# EAGLE design mini-midi-merge (EAGLE 6.6.0)
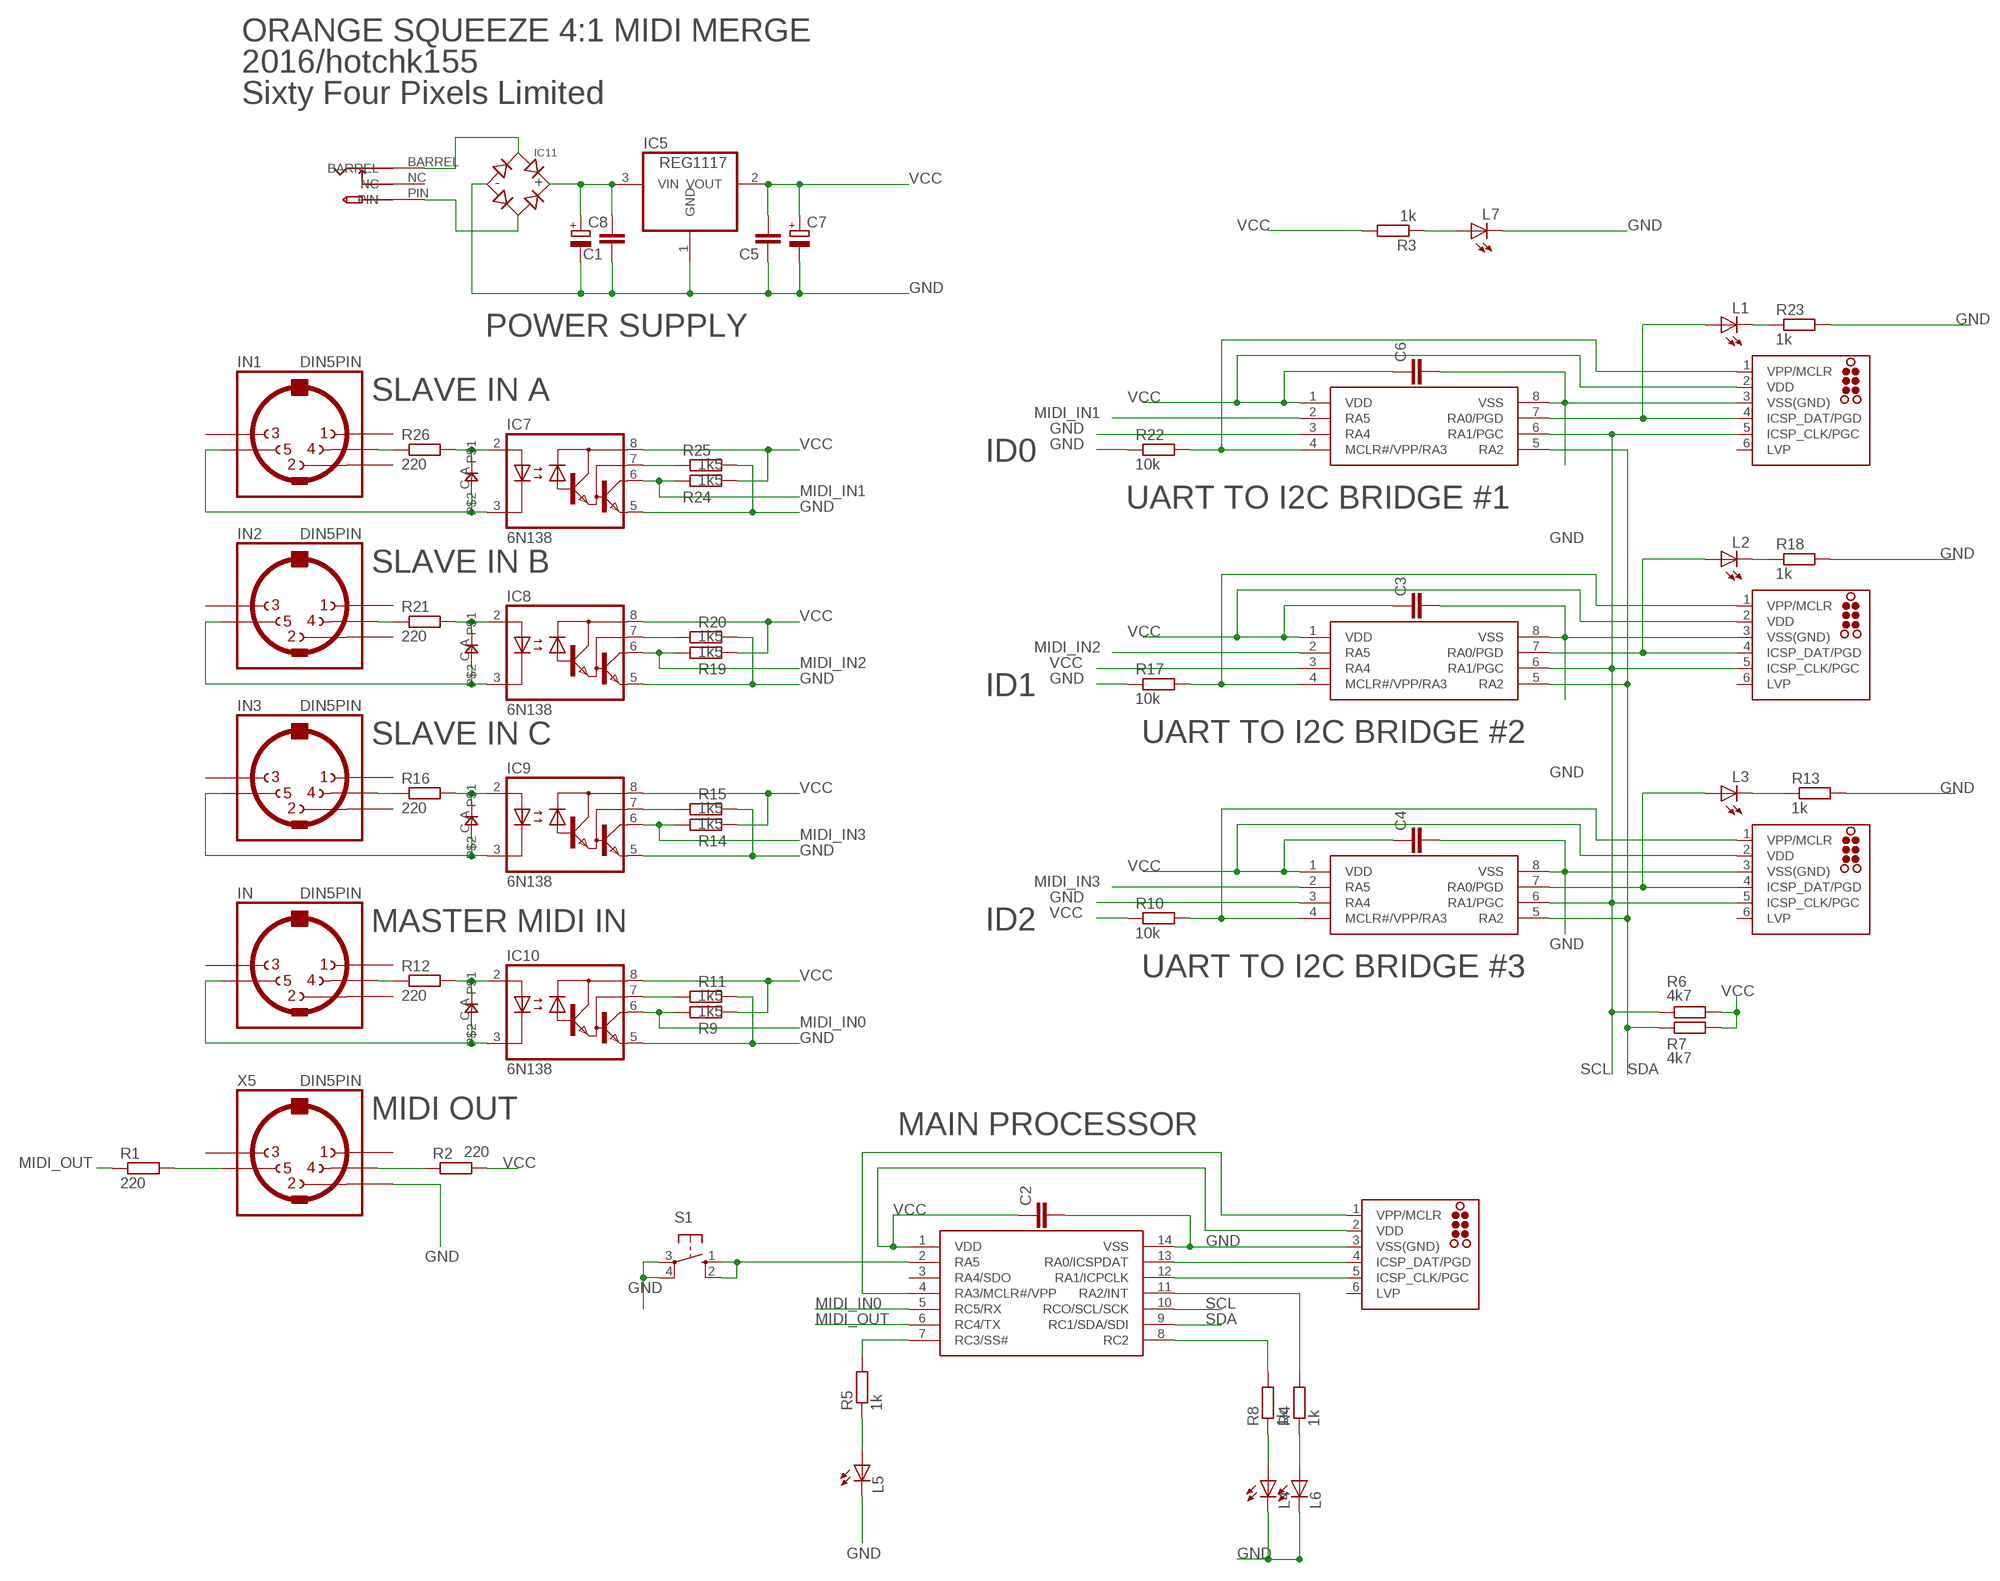
[diagram p0: schematic, sheet 1]

## Parts
C1  C-EUC0805  [C0805]
C2  C-EUC0805  [C0805]
C3  C-EUC0805  [C0805]
C4  C-EUC0805  [C0805]
C5  C-EUC0805  [C0805]
C6  C-EUC0805  [C0805]
C7  CPOL-EUE2,5-6E  [E2,5-6E]
C8  CPOL-EUE2,5-6E  [E2,5-6E]
D1  0805DIODE  [0805DIODE]
D2  0805DIODE  [0805DIODE]
D3  0805DIODE  [0805DIODE]
D4  0805DIODE  [0805DIODE]
IC1  PIC16F1825SO14  [SO14]
IC2  PIC12F1822SO08  [SO08]
IC3  PIC12F1822SO08  [SO08]
IC4  PIC12F1822SO08  [SO08]
IC5  REG1117  [SOT223]
IC7  6N138  [DIL08]
IC8  6N138  [DIL08]
IC9  6N138  [DIL08]
IC10  6N138  [DIL08]
IC11  BRIDGERECTIFIER  [SOIC-4]
ICSP1  TC2030-MCP-NL  [TC2030-MCP-NL]
ICSP2  TC2030-MCP-NL  [TC2030-MCP-NL]
ICSP3  TC2030-MCP-NL  [TC2030-MCP-NL]
ICSP4  TC2030-MCP-NL  [TC2030-MCP-NL]
IN  DIN5PIN  [EDGEDIN]
IN1  DIN5PIN  [EDGEDIN]
IN2  DIN5PIN  [EDGEDIN]
IN3  DIN5PIN  [EDGEDIN]
L1  LED3MM  [LED3MM]
L2  LED3MM  [LED3MM]
L3  LED3MM  [LED3MM]
L4  LED3MM  [LED3MM]
L5  LED3MM  [LED3MM]
L6  LED3MM  [LED3MM]
L7  LED3MM  [LED3MM]
R1  220  R-EU_R0805  [R0805]
R2  220  R-EU_R0805  [R0805]
R3  1k  R-EU_R0805  [R0805]
R4  1k  R-EU_R0805  [R0805]
R5  1k  R-EU_R0805  [R0805]
R6  4k7  R-EU_R0805  [R0805]
R7  4k7  R-EU_R0805  [R0805]
R8  1k  R-EU_R0805  [R0805]
R9  1k5  R-EU_R0805  [R0805]
R10  10k  R-EU_R0805  [R0805]
R11  1k5  R-EU_R0805  [R0805]
R12  220  R-EU_R0805  [R0805]
R13  1k  R-EU_R0805  [R0805]
R14  1k5  R-EU_R0805  [R0805]
R15  1k5  R-EU_R0805  [R0805]
R16  220  R-EU_R0805  [R0805]
R17  10k  R-EU_R0805  [R0805]
R18  1k  R-EU_R0805  [R0805]
R19  1k5  R-EU_R0805  [R0805]
R20  1k5  R-EU_R0805  [R0805]
R21  220  R-EU_R0805  [R0805]
R22  10k  R-EU_R0805  [R0805]
R23  1k  R-EU_R0805  [R0805]
R24  1k5  R-EU_R0805  [R0805]
R25  1k5  R-EU_R0805  [R0805]
R26  220  R-EU_R0805  [R0805]
S1  10-XX  [B3F-10XX]
U$9  PWR_SOCKET_2_1MM  [PWR_SOCKET_2_1MM]
X5  DIN5PIN  [EDGEDIN]

## Nets
GND: C1.1 C2.2 C3.2 C4.2 C5.1 C6.2 C7.- C8.- IC1.14(VSS) IC2.3(RA4) IC2.8(VSS) IC3.8(VSS) IC4.3(RA4) IC4.8(VSS) IC5.1(GND) IC7.5(GND) IC8.5(GND) IC9.5(GND) IC10.5(GND) IC11.- ICSP1.3(VSS(GND)) ICSP2.3(VSS(GND)) ICSP3.3(VSS(GND)) ICSP4.3(VSS(GND)) L4.K(C) L5.K(C) L6.K(C) L7.K(C) R11.2 R13.2 R15.2 R17.1 R18.2 R20.2 R22.1 R23.2 R25.2 S1.3(P) S1.4(P1) X5.2
MIDI_IN0: IC1.5(RC5/RX) IC10.6(VO) R9.1
MIDI_IN1: IC4.2(RA5) IC7.6(VO) R24.1
MIDI_IN2: IC3.2(RA5) IC8.6(VO) R19.1
MIDI_IN3: IC2.2(RA5) IC9.6(VO) R14.1
MIDI_OUT: IC1.6(RC4/TX) R1.1
N$1: IN3.4 R16.1
N$2: D2.A IC9.2(A) R16.2
N$3: D2.C IC9.3(C) IN3.5
N$4: IN2.4 R21.1
N$5: IC9.7(VB) R15.1
N$6: D3.A IC8.2(A) R21.2
N$7: D3.C IC8.3(C) IN2.5
N$8: IC8.7(VB) R20.1
N$9: IN1.4 R26.1
N$10: D4.A IC7.2(A) R26.2
N$11: D4.C IC7.3(C) IN1.5
N$12: IC7.7(VB) R25.1
N$13: IN.4 R12.1
N$14: D1.A IC10.2(A) R12.2
N$15: D1.C IC10.3(C) IN.5
N$16: IC10.7(VB) R11.1
N$17: IC3.4(MCLR#/VPP/RA3) ICSP3.1(VPP/MCLR) R17.2
N$18: IC4.4(MCLR#/VPP/RA3) ICSP4.1(VPP/MCLR) R22.2
N$19: L4.A R8.1
N$20: C1.2 C8.+ IC5.3(VIN) IC11.+
N$21: L7.A R3.1
N$22: R1.2 X5.5
N$23: IC4.7(RA0/PGD) ICSP4.4(ICSP_DAT/PGD) L1.A
N$24: L1.K(C) R23.1
N$25: IC2.7(RA0/PGD) ICSP2.4(ICSP_DAT/PGD) L3.A
N$26: L2.K(C) R18.1
N$27: IC2.4(MCLR#/VPP/RA3) ICSP2.1(VPP/MCLR) R10.2
N$28: R2.1 X5.4
N$30: IC3.7(RA0/PGD) ICSP3.4(ICSP_DAT/PGD) L2.A
N$31: L3.K(C) R13.1
N$32: IC1.4(RA3/MCLR#/VPP) ICSP1.1(VPP/MCLR)
N$33: L6.A R4.1
N$34: IC1.13(RA0/ICSPDAT) ICSP1.4(ICSP_DAT/PGD)
N$35: IC1.12(RA1/ICPCLK) ICSP1.5(ICSP_CLK/PGC)
N$36: IC1.8(RC2) R8.2
N$37: IC1.11(RA2/INT) R4.2
N$38: IC11.~1(AC1) U$9.BARREL
N$39: IC11.~2(AC2) U$9.PIN
N$40: IC1.2(RA5) S1.1(S) S1.2(S1)
N$41: IC1.7(RC3/SS#) R5.2
N$42: L5.A R5.1
SCL: IC1.10(RCO/SCL/SCK) IC2.6(RA1/PGC) IC3.6(RA1/PGC) IC4.6(RA1/PGC) ICSP2.5(ICSP_CLK/PGC) ICSP3.5(ICSP_CLK/PGC) ICSP4.5(ICSP_CLK/PGC) R6.1
SDA: IC1.9(RC1/SDA/SDI) IC2.5(RA2) IC3.5(RA2) IC4.5(RA2) R7.1
VCC: C2.1 C3.1 C4.1 C5.2 C6.1 C7.+ IC1.1(VDD) IC2.1(VDD) IC3.1(VDD) IC3.3(RA4) IC4.1(VDD) IC5.2(VOUT) IC7.8(VCC) IC8.8(VCC) IC9.8(VCC) IC10.8(VCC) ICSP1.2(VDD) ICSP2.2(VDD) ICSP3.2(VDD) ICSP4.2(VDD) R2.2 R3.2 R6.2 R7.2 R9.2 R10.1 R14.2 R19.2 R24.2
Unconnected: IC1.3(RA4/SDO) ICSP1.6(LVP) ICSP2.6(LVP) ICSP3.6(LVP) ICSP4.6(LVP) IN1.1 IN1.2 IN1.3 IN2.1 IN2.2 IN2.3 IN3.1 IN3.2 IN3.3 IN.1 IN.2 IN.3 U$9.NC X5.1 X5.3

## Notes on the sheet
- ORANGE SQUEEZE 4:1 MIDI MERGE
- 2016/hotchk155
- Sixty Four Pixels Limited
- POWER SUPPLY
- SLAVE IN A
- ID0
- UART TO I2C BRIDGE #1
- SLAVE IN B
- ID1
- SLAVE IN C | UART TO I2C BRIDGE #2
- MASTER MIDI IN | ID2
- UART TO I2C BRIDGE #3
- MIDI OUT
- MAIN PROCESSOR

## Library data of the parts
C1-C6 = rcl:C-EU: CAPACITOR, European symbol
C7 C8 = rcl:CPOL-EU: POLARIZED CAPACITOR, European symbol
D1-D4 = jasons_stuff:0805DIODE
IC1 = jasons_stuff:PIC16F1825
IC2-IC4 = jasons_stuff:PIC12F1822
IC5 = burr-brown:REG1117: 800mA and 1A Low Dropout (LDO) Positive Regulator 1.8V, 2.5V, 2.85V, 3.3V, 5V, and Adj; MPN: REG1117; OC_FARNELL: 1097566; OC_NEWARK: 14P6981
IC7-IC10 = optocoupler:6N138: MOTOROLA OPTO COUPLER; MF: VISHAY/TELEFUNKEN; MPN: 6N138; OC_FARNELL: 9860150; OC_NEWARK: 35K5294
IC11 = microbuilder:BRIDGERECTIFIER: Bridge Rectifier SOIC-4: Comchip B4S-G - 400V 800mA, Peak Vf 1.1V (Digikey: 641-1334-1-ND)
ICSP1-ICSP4 = tag-connect:TC2030: TAG-CONNECT ICSP Connector Manufacturer: Tag-Connect <http://www.tag-connect.com> Cable for easy In-Circuit Serial Programming. Designed for Microchip ICD2, suitable for many others. Two variants - one "with legs" (for hands-free fit on PCB) and another "without legs" for quick programming. PAD Description 1 MCLR/Vpp 2 Vdd 3 GND 4 PGD (ISPDAT) 5 PGC (ISPCLK) 6 nc (used for LVP) ©2009 ROFA.cz - modified and updated by Robert Darlington ‹rdarlington@gmail.com›
IN IN1-IN3 X5 = jason_eagle6:DIN5PIN: Female CONNECTOR 5 pins 90 deg. with shield, horizontal (DIN 41524)
L1-L7 = led:LED: LED OSRAM: - CHIPLED LG R971, LG N971, LY N971, LG Q971, LY Q971, LO R971, LY R971 LH N974, LH R974 LS Q976, LO Q976, LY Q976 LO Q996 - Hyper CHIPLED LW Q18S LB Q993, LB Q99A, LB R99A - SideLED LS A670, LO A670, LY A670, LG A670, LP A670 LB A673, LV A673, LT A673, LW A673 LH A674 LY A675 LS A676, LA A676, LO A676, LY A676, LW A676 LS A679, LY A679, LG A679 - Hyper Micro SIDELED® LS Y876, LA Y876, LO Y876, LY Y876 LT Y87S - SmartLED LW L88C, LW L88S LB L89C, LB L89S, LG L890 LS L89K, LO L89K, LY L89K LS L896, LA L896, LO L896, LY L896 - TOPLED LS T670, LO T670, LY T670, LG T670, LP T670 LSG T670, LSP T670, LSY T670, LOP T670, LYG T670 LG T671, LOG T671, LSG T671 LB T673, LV T673, LT T673, LW T673 LH T674 LS T676, LA T676, LO T676, LY T676, LB T676, LH T676, LSB T676, LW T676 LB T67C, LV T67C, LT T67C, LS T67K, LO T67K, LY T67K, LW E67C LS E67B, LA E67B, LO E67B, LY E67B, LB E67C, LV E67C, LT E67C LW T67C LS T679, LY T679, LG T679 LS T770, LO T770, LY T770, LG T770, LP T770 LB T773, LV T773, LT T773, LW T773 LH T774 LS E675, LA E675, LY E675, LS T675 LS T776, LA T776, LO T776, LY T776, LB T776 LHGB T686 LT T68C, LB T68C - Hyper Mini TOPLED® LB M676 - Mini TOPLED Santana® LG M470 LS M47K, LO M47K, LY M47K Source: http://www.osram.convergy.de LUXEON: - LUMILED® LXK2-PW12-R00, LXK2-PW12-S00, LXK2-PW14-U00, LXK2-PW14-V00 LXK2-PM12-R00, LXK2-PM12-S00, LXK2-PM14-U00 LXK2-PE12-Q00, LXK2-PE12-R00, LXK2-PE12-S00, LXK2-PE14-T00, LXK2-PE14-U00 LXK2-PB12-K00, LXK2-PB12-L00, LXK2-PB12-M00, LXK2-PB14-N00, LXK2-PB14-P00, LXK2-PB14-Q00 LXK2-PR12-L00, LXK2-PR12-M00, LXK2-PR14-Q00, LXK2-PR14-R00 LXK2-PD12-Q00, LXK2-PD12-R00, LXK2-PD12-S00 LXK2-PH12-R00, LXK2-PH12-S00 LXK2-PL12-P00, LXK2-PL12-Q00, LXK2-PL12-R00 Source: www.luxeon.com KINGBRIGHT: KA-3528ASYC Source: www.kingbright.com
R1-R26 = rcl:R-EU_: RESISTOR, European symbol
S1 = switch-omron:10-XX: OMRON SWITCH; MPN: B3F-1000; OC_FARNELL: 176432; OC_NEWARK: 36M3542
U$9 = jason_eagle6:PWR_SOCKET_2_1MM

## Board
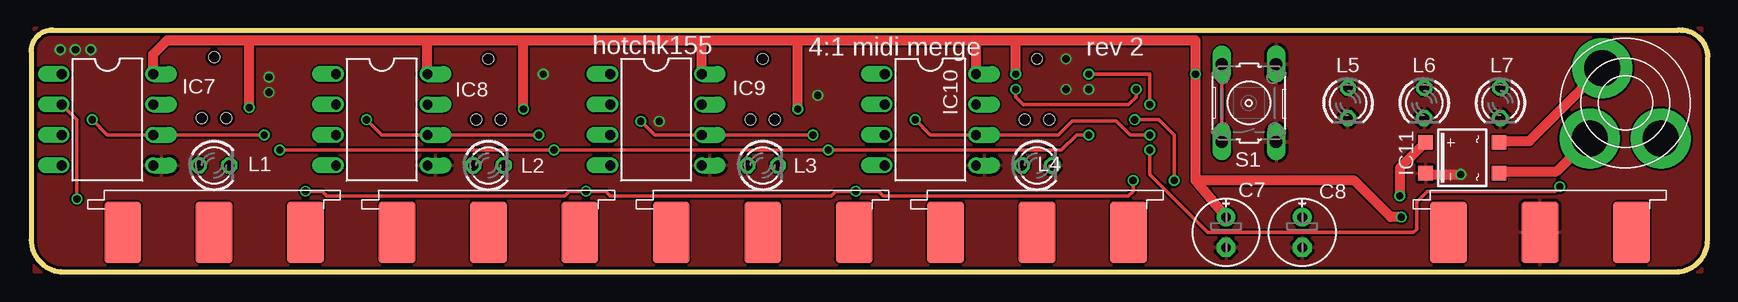
[diagram p1: board, top side]
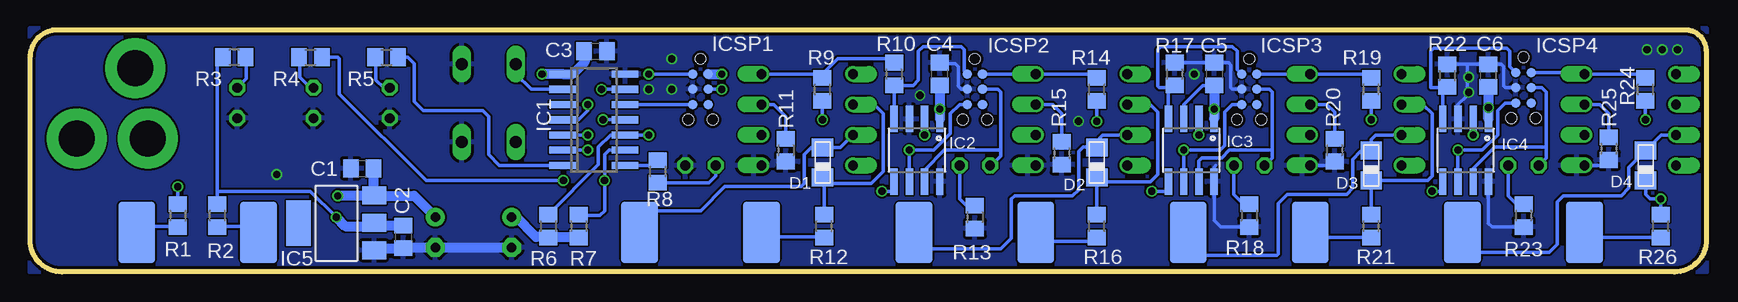
[diagram p2: board, bottom side, seen from below]

Size 139.7 x 20.19 mm. Coordinates in mm from the lower left corner, seen from the top.
Outline: 137.29,20.19 1.78,20.19 arc90 0,18.41 0,2.67 arc90 2.67,0 137.03,0 arc90 139.7,2.67 139.7,17.91 arc90 137.41,20.19
Copper layers (1*16): Top 0.035mm / dielectric 1.5mm / Bottom 0.035mm
Design rules "ITEADstudio_DRC": minimum track width 6mil, minimum drill 12mil, track to track 6mil, track to pad 6mil, pad to pad 6mil, via to via 6mil, smd to smd 0mil, copper to edge 10mil, drill to drill 10mil, minimum pad ring 10mil, minimum via ring 6mil, stop-mask expansion 2mil, vias tented up to drill 100mil, thermal gap 10mil

### Footprints (pad centres in the part's own frame; a part is rotated, then mirrored left to right if it is on the bottom)
C0805 = smd 1.3 x 1.5: 1 -0.95,0; 2 0.95,0
E2,5-6E = drill 0.813 pad 1.575: + -1.27,0 | drill 0.813 pad 1.575 octagon: - 1.27,0
0805DIODE = smd 1.524 x 1.778: A -1.262,-0.005; C 1.238,-0.005
SO14 = smd 0.6 x 2.2: 1 -3.81,-2.6; 2 -2.54,-2.6; 3 -1.27,-2.6; 4 0,-2.6; 5 1.27,-2.6; 6 2.54,-2.6; 7 3.81,-2.6; 8 3.81,2.6; 9 2.54,2.6; 10 1.27,2.6; 11 0,2.6; 12 -1.27,2.6; 13 -2.54,2.6; 14 -3.81,2.6
SO08 = smd 0.61 x 2.21: 1 -1.905,-2.616; 2 -0.635,-2.616; 3 0.635,-2.616; 4 1.905,-2.616; 5 1.905,2.616; 6 0.635,2.616; 7 -0.635,2.616; 8 -1.905,2.616
SOT223 = smd 1.499 x 2.007: 1 -2.261,-3.15; 2 0.025,-3.15; 3 2.311,-3.15 | smd 3.81 x 2.007: 4 0,3.15
DIL08 = drill 0.813 offset: 1 -3.81,-3.81; 2 -1.27,-3.81; 3 1.27,-3.81; 4 3.81,-3.81; 5 3.81,3.81; 6 1.27,3.81; 7 -1.27,3.81; 8 -3.81,3.81
SOIC-4 = smd 1.2 x 1.2: + 1.3,3.05; - -1.3,3.05; ~1 -1.3,-3.05; ~2 1.3,-3.05
TC2030-MCP-NL = smd 0.787 x 0.787: 1 1.27,-0.635; 2 1.27,0.635; 3 2.54,-0.635; 4 2.54,0.635; 5 3.81,-0.635; 6 3.81,0.635 | hole 0.889: 0,0; 5.08,-1.016; 5.08,1.016
EDGEDIN = smd 3.048 x 5.08: 1 -7.62,-10.16; 2 0,-10.16; 3 7.62,-10.16 | smd 3.048 x 5.08 bottom: 4 -5.08,-10.16; 5 5.08,-10.16
LED3MM = drill 0.813 octagon: A -1.27,0; K 1.27,0
R0805 = smd 1.3 x 1.5: 1 -0.95,0; 2 0.95,0
B3F-10XX = drill 1.016 long: 1 -3.251,2.261; 2 3.251,2.261; 3 -3.251,-2.261; 4 3.251,-2.261
PWR_SOCKET_2_1MM = drill 3 pad 5: BARREL 0,4.2; NC -4.2,0; PIN 3.4,-0.7

### Placement (x,y rotation side)
C1  112.01,8.64 0 bottom
C2  108.58,2.92 270 bottom
C3  92.58,18.41 0 bottom
C4  63.88,16.51 90 bottom
C5  41.02,16.51 270 bottom
C6  18.16,16.38 90 bottom
C7  99.57,3.3 270 top
C8  105.92,3.3 270 top
D1  73.66,9.14 90 bottom
D2  50.8,9.14 90 bottom
D3  27.94,8.89 90 bottom
D4  5.08,8.89 90 bottom
IC1  92.71,12.7 270 bottom
IC2  65.79,10.16 180 bottom
IC3  42.93,10.16 180 bottom
IC4  20.07,10.16 180 bottom
IC5  114.17,4.06 90 bottom
IC7  6.35,12.7 270 top
IC8  29.21,12.7 270 top
IC9  52.07,12.7 270 top
IC10  74.93,12.7 270 top
IC11  119.25,9.53 90 top
ICSP1  83.82,17.78 270 bottom
ICSP2  60.96,17.78 270 bottom
ICSP3  38.1,17.78 270 bottom
ICSP4  15.24,17.91 270 bottom
IN  83.82,13.46 0 top
IN1  15.24,13.46 0 top
IN2  38.1,13.46 0 top
IN3  60.96,13.46 0 top
L1  15.24,8.89 0 top
L2  38.1,8.89 0 top
L3  60.96,8.89 0 top
L4  83.82,8.89 0 top
L5  109.73,14.1 270 top
L6  116.08,14.1 270 top
L7  122.43,14.1 270 top
R1  127.38,4.7 270 bottom
R2  124.08,4.7 90 bottom
R3  122.68,17.91 180 bottom
R4  116.33,17.91 0 bottom
R5  109.98,17.91 0 bottom
R6  96.52,3.81 270 bottom
R7  93.98,3.81 270 bottom
R8  87.38,8.38 90 bottom
R9  73.66,15.24 90 bottom
R10  67.69,16.51 270 bottom
R11  76.71,10.16 270 bottom
R12  73.53,3.81 90 bottom
R13  60.96,4.57 270 bottom
R14  50.8,15.24 90 bottom
R15  53.72,9.91 270 bottom
R16  50.8,3.81 90 bottom
R17  44.32,16.51 270 bottom
R18  38.1,4.7 270 bottom
R19  27.94,15.24 90 bottom
R20  30.99,10.16 270 bottom
R21  27.94,3.81 90 bottom
R22  21.59,16.38 270 bottom
R23  15.24,4.7 270 bottom
R24  5.08,15.24 90 bottom
R25  8.13,10.29 270 bottom
R26  3.81,3.81 90 bottom
S1  101.47,14.1 90 top
U$9  132.84,14.1 135 top
X5  125.73,13.46 0 top

### Tracks (layer width: path | path; a pad name or v marks a point on that pad's centre or on a via)
GND  (via drill 0.6)
  Top 0.813: IC11.- 116.3,8.13 v119.13,8.13
  Bottom 0.305: IC7.5 8.57,8.89 R25.2 | IC4.3 20.7,13.97 19.94,14.73 19.94,17.27 20,17.33 R22.1 C6.2 17.08,17.33 16.89,17.14 16.89,15.49 16.76,15.37 ICSP4.3 | 18.09,7.62 IC4.8 18.16,4.06 17.85,3.75 R23.2 | R17.1 C5.1 39.81,17.46 39.62,17.27 39.62,15.37 39.5,15.24 ICSP3.3 | IC8.5 31.31,8.89 R20.2 | 40.89,8.89 41.02,8.76 IC3.8 41.02,4.32 40.45,3.75 R18.2 | ICSP2.3 62.1,15.24 62.36,15.49 62.36,17.14 62.61,17.4 63.82,17.4 C4.2
  Bottom 0.813: IC5.1 110.86,1.97 C2.2 108.52,2.03 C8.- C7.-
  other vias: 2.41,18.54 3.68,18.54 4.95,18.54 19.81,16.26 19.81,14.99 42.67,16.51 52.32,12.57 65.53,14.73 86.23,15.24 86.23,17.78 88.14,15.24
  pour Bottom: 0,20.32 0,0 139.7,0 139.7,20.32
  pour Top: 0.25,20.32 0.25,0 139.19,0 139.19,20.32
MIDI_IN0  (via drill 0.6)
  Top 0.305: v73.66,12.7 74.93,11.43 IC10.6 85.6,11.43 86.74,12.57 90.42,12.57 91.57,11.43 v93.22,11.43
  Bottom 0.305: R9.1 v73.66,12.7 | v93.22,11.43 IC1.5
MIDI_IN1  (via drill 0.6)
  Top 0.305: v5.08,12.7 6.35,11.43 IC7.6 v19.43,11.43
  Bottom 0.305: R24.1 v5.08,12.7 | IC4.2 v19.43,11.43
MIDI_IN2  (via drill 0.6)
  Top 0.305: v27.94,12.7 29.21,11.43 IC8.6 v42.29,11.43
  Bottom 0.305: R19.1 v27.94,12.7 | v42.29,11.43 IC3.2
MIDI_IN3  (via drill 0.6)
  Top 0.305: v50.8,12.57 51.94,11.43 IC9.6 v65.15,11.43
  Bottom 0.305: R14.1 v50.8,12.57 | IC2.2 v65.15,11.43
MIDI_OUT  (via drill 0.6)
  Top 0.305: v127.38,7.11 127,6.73 116.33,6.73 115.44,5.84 115.44,3.56 115.19,3.3 98.04,3.3 93.22,8.13 v93.22,10.16
  Bottom 0.305: IC1.6 v93.22,10.16 | R1.1 v127.38,7.11
N$1
  Bottom 0.305: R16.1 51.12,2.54 55.88,2.54 IN3.4
N$2
  Bottom 0.305: R16.2 D2.A 50.42,7.49 46.36,7.49 45.72,8.13 45.72,13.34 46.36,13.97 IC9.2
N$3
  Bottom 0.305: 49.15,11.43 IC9.3 50.29,11.43 50.55,11.18 50.55,10.63 D2.C 50.83,10.41 51.94,10.41 52.32,10.03 52.32,6.86 52.83,6.35 57.66,6.35 57.91,6.1 57.91,2.79 58.8,1.91 65.91,1.91 66.04,2.03 IN3.5
N$4
  Bottom 0.305: R21.1 32.58,2.86 IN2.4
N$5
  Bottom 0.305: R15.1 53.72,13.21 54.48,13.97 IC9.7
N$6
  Bottom 0.305: R21.2 D3.A 23.23,7.63 22.86,8 22.86,13.21 23.62,13.97 IC8.2
N$7
  Bottom 0.305: IC8.3 27.56,11.43 27.94,11.05 D3.C | D3.C | D3.C 27.97,10.16 28.57,10.16 28.7,10.03 28.83,10.03 29.46,9.4 29.46,6.99 29.97,6.48 34.93,6.48 35.69,5.71 35.69,1.52 35.81,1.4 43.18,1.4 IN2.5
N$8
  Bottom 0.305: R20.1 30.99,13.34 31.62,13.97 IC8.7
N$9
  Bottom 0.305: R26.1 9.72,2.86 IN1.4
N$10  (via drill 0.6)
  Top 0.305: IC7.2 3.81,12.7 v3.81,6.1
  Bottom 0.305: D4.A 5.08,6.47 4.7,6.1 v3.81,6.1 R26.2
N$11
  Bottom 0.305: IC7.3 3.77,11.43 D4.C 6.48,8.73 6.48,6.99 7.11,6.35 11.94,6.35 12.45,5.84 12.45,2.29 13.08,1.65 19.94,1.65 20.32,1.27 IN1.5
N$12
  Bottom 0.305: R25.1 8.13,13.21 8.89,13.97 IC7.7
N$13
  Bottom 0.305: R12.1 73.59,2.92 78.36,2.92 IN.4
N$14
  Bottom 0.305: D1.A 73.53,7.76 73.53,7.37 | 73.53,7.37 R12.2 | IC10.2 69.34,13.97 68.58,13.21 68.58,8.38 69.6,7.37 73.53,7.37
N$15
  Bottom 0.305: IC10.3 72.17,10.38 D1.C 74.58,10.38 75.18,9.78 75.18,7.37 75.44,7.11 81.79,7.11 83.82,5.08 88.9,5.08 IN.5
N$16
  Bottom 0.305: R11.1 76.71,12.95 77.72,13.97 IC10.7
N$17
  Bottom 0.305: IC3.4 44.83,15.05 | 44.83,15.05 R17.2 | ICSP3.1 39.12,16.89 39.12,18.41 39.5,18.8 45.47,18.8 45.72,18.54 45.72,15.49 45.59,15.37 44.83,15.37 44.83,15.05
N$18
  Bottom 0.305: ICSP4.1 16.38,17.14 16.38,18.41 16.64,18.67 22.73,18.67 22.99,18.41 22.99,15.37 21.66,15.37 R22.2 21.97,15.05 IC4.4
N$19
  Bottom 0.305: R8.1 83.12,7.43 82.55,8 L4.A
N$20  (via drill 0.6)
  Top 0.813: IC11.+ 114.05,8.67 v114.05,6.35
  Bottom 0.813: v114.05,6.35 114.02,6.38 IC5.3 | IC5.3 111,6.35 107.7,6.35 C8.+ | IC5.3 111.06,6.42 C1.2
N$21
  Bottom 0.305: R3.1 121.67,17.84 121.67,16.13 L7.A
N$22
  Bottom 0.305: R1.2 127.44,3.81 130.43,3.81 130.81,3.43 X5.5
N$23
  Bottom 0.305: 13.34,10.41 13.34,9.53 L1.A | 13.34,10.41 13.34,14.99 13.72,15.37 ICSP4.4 | IC4.7 19.43,8.64 17.65,10.41 13.34,10.41
N$24
  Bottom 0.305: L1.K 16.51,6.35 15.81,5.65 R23.1
N$25
  Bottom 0.305: IC2.7 65.15,8.51 63.5,10.16 58.8,10.16 | ICSP2.4 59.05,15.24 58.8,14.99 58.8,10.16 | 58.8,10.16 58.8,9.65 59.56,8.89 L3.A
N$26
  Bottom 0.305: L2.K 39.37,6.48 38.54,5.65 R18.1
N$27
  Bottom 0.305: ICSP2.1 61.85,16.76 61.85,18.54 62.1,18.8 65.28,18.8 65.66,18.41 65.66,16 66.1,15.56 R10.2 IC2.4
N$28
  Bottom 0.305: R2.1 124.02,3.81 120.9,3.81 120.65,3.56 X5.4
N$30
  Bottom 0.305: ICSP3.4 36.45,15.24 36.2,14.99 36.2,10.16 | 36.2,10.16 36.2,9.53 L2.A | IC3.7 42.29,9.27 42.04,9.53 40.39,9.53 39.75,10.16 36.2,10.16
N$31
  Bottom 0.305: L3.K 62.23,6.1 61.66,5.52 R13.1
N$32  (via drill 0.6)
  Top 0.305: v93.22,13.97 93.22,16.51 v88.14,16.51
  Bottom 0.305: v88.14,16.51 ICSP1.1 | IC1.4 93.98,12.7 93.22,13.46 v93.22,13.97
N$33
  Bottom 0.305: R4.1 117.22,17.85 117.22,16.26 116.33,15.37 L6.A
N$34  (via drill 0.6)
  Top 0.305: v82.04,15.24 82.04,14.61 82.68,13.97 91.44,13.97 92.07,14.61 v92.07,15.24
  Bottom 0.305: IC1.13 v92.07,15.24 | ICSP1.4 v82.04,15.24
N$35
  Bottom 0.305: IC1.12 ICSP1.5
N$36
  Bottom 0.305: IC1.8 87.82,8.89 R8.2
N$37  (via drill 0.6)
  Top 0.305: v95.25,7.62 95.25,11.43 93.98,12.7 v91.95,12.7
  Bottom 0.305: 115.38,17.59 R4.2 114.05,17.91 113.92,17.78 113.92,14.86 106.68,7.62 v95.25,7.62 | IC1.11 v91.95,12.7
N$38
  Top 0.813: IC11.~1 122.46,8.38 127.13,8.38 U$9.BARREL
N$39
  Top 0.813: IC11.~2 122.4,10.92 124.84,10.92 130.92,17 U$9.PIN
N$40
  Top 0.305: S1.1 S1.2
  Bottom 0.305: IC1.2 97.94,15.24 99.21,16.51 S1.2
N$41
  Bottom 0.305: R5.2 108.2,17.91 107.7,17.4 107.7,14.22 106.93,13.46 101.98,13.46 101.47,12.95 101.47,9.78 100.58,8.89 IC1.7
N$42
  Bottom 0.305: R5.1 110.87,17.85 110.87,16 110.24,15.37 L5.A
SCL  (via drill 0.6)
  Top 0.305: v20.7,10.16 v43.56,10.16 v66.42,10.16 85.85,10.16 87.12,11.43 v88.14,11.43
  Bottom 0.305: ICSP4.5 16.76,14.1 17.4,13.46 17.4,11.43 18.67,10.16 v20.7,10.16 IC4.6 | 43.56,9.02 IC3.6 v43.56,10.16 40.51,10.16 40.13,10.54 40.13,13.34 39.5,13.97 ICSP3.5 | 66.42,8.76 IC2.6 v66.42,10.16 64.39,10.16 62.99,11.56 62.99,13.21 62.23,13.97 ICSP2.5 | R6.1 92.33,8.95 92.33,10.41 91.31,11.43 IC1.10 v88.14,11.43
SDA  (via drill 0.6)
  Top 0.305: v22.86,6.73 24.26,6.73 24.64,6.35 44.45,6.35 44.83,6.73 v46.23,6.73 47.88,6.73 48.26,6.35 66.67,6.35 67.06,6.73 v68.71,6.73 70.61,6.73 70.99,6.35 91.44,6.35 91.82,6.73 v91.82,7.62
  Bottom 0.305: IC4.5 21.97,6.73 v22.86,6.73 | v46.23,6.73 44.96,6.73 44.83,6.86 IC3.5 | IC2.5 67.69,6.73 v68.71,6.73 | 94.36,5.14 R7.1 93.92,4.7 92.2,4.7 91.82,5.08 v91.82,7.62 91.82,9.78 91.44,10.16 IC1.9
VCC  (via drill 0.6)
  Top 0.813: IC7.8 10.16,18.16 11.3,19.3 18.16,19.3 | C7.+ 97.03,7.62 | 97.03,7.62 v97.03,16.51 97.03,19.3 82.04,19.3 | 82.04,19.3 78.74,19.3 | 78.74,19.3 63.88,19.3 | 63.88,19.3 55.88,19.3 | 55.88,19.3 41.02,19.3 | 41.02,19.3 33.02,19.3 | 33.02,19.3 18.16,19.3 | v18.16,13.72 18.16,19.3 | v41.02,13.59 41.02,19.3 | IC8.8 33.02,19.3 | IC10.8 78.74,19.3 | v63.88,13.59 63.88,19.3 | IC9.8 55.88,19.3 | v114.17,4.57 113.28,4.57 110.24,7.62 97.03,7.62 | v82.04,16.51 82.04,19.3
  Bottom 0.305: R24.2 5.4,16.51 IC7.8 10.29,16.64 ICSP4.2 | R19.2 28.26,16.51 IC8.8 ICSP3.2 | C5.2 41.97,15.56 43.56,13.97 IC3.3 | ICSP2.2 IC9.8 51.31,16.51 50.99,16.19 R14.2 | IC10.8 73.66,16.51 | R10.1 68.01,17.78 72.39,17.78 73.66,16.51 | 73.66,16.51 R9.2 | 124.02,5.65 R2.2 124.08,6.73 | v114.17,4.57 116.33,6.73 124.08,6.73 | 124.08,6.73 124.08,17.53 123.7,17.91 R3.2 | 110.8,3.87 110.74,3.81 110.49,3.81
  Bottom 0.406: 93.53,18.29 C3.1
  Bottom 0.813: C6.1 IC4.1 v18.16,13.72 | IC3.1 C5.2 v41.02,13.59 | IC2.1 C4.1 v63.88,13.59 | C3.1 93.47,18.35 93.47,17.53 94.49,16.51 IC1.1 v97.03,16.51 | R7.2 R6.2 96.58,2.92 97.54,2.92 99.19,4.57 C7.+ | IC5.2 110.8,3.87 C2.1 | v114.17,4.57 113.41,3.81 110.49,3.81 | ICSP1.2 v82.04,16.51

### Text on the board
tNames: hotchk155 | 4:1 midi merge | rev 2